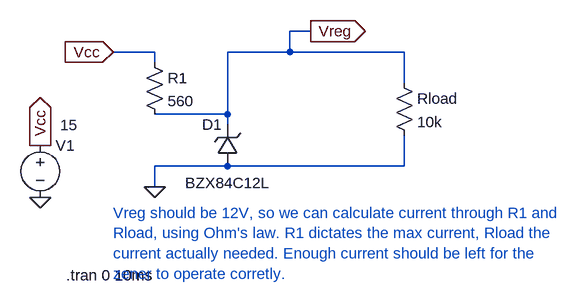
[diagram p0: schematic zener-voltage-regulation.asc]
zener-voltage-regulation.asc, the LTspice schematic file:
Version 4
SHEET 1 2464 680
WIRE 448 144 416 144
WIRE 208 176 144 176
WIRE 416 176 416 144
WIRE 416 176 320 176
WIRE 592 176 416 176
WIRE 208 192 208 176
WIRE 592 224 592 176
WIRE 320 272 320 176
WIRE 320 272 208 272
WIRE 320 288 320 272
WIRE 320 352 208 352
WIRE 592 352 592 304
WIRE 592 352 320 352
WIRE 208 384 208 352
FLAG 208 384 0
FLAG 32 400 0
FLAG 32 320 Vcc
IOPIN 32 320 Out
FLAG 144 176 Vcc
IOPIN 144 176 In
FLAG 448 144 Vreg
IOPIN 448 144 Out
SYMBOL Res 192 176 R0
SYMATTR InstName R1
SYMATTR Value 560
SYMBOL zener 336 352 R180
WINDOW 3 -50 -26 Left 2
WINDOW 0 24 64 Left 2
SYMATTR Value BZX84C12L
SYMATTR InstName D1
SYMBOL Voltage 32 304 R0
WINDOW 3 31 -15 Left 2
SYMATTR Value 15
SYMATTR InstName V1
SYMBOL Res 576 208 R0
SYMATTR InstName Rload
SYMATTR Value 10k
TEXT 72 520 Left 2 !.tran 0 10ms
TEXT 144 424 Left 2 ;Vreg should be 12V, so we can calculate current through R1 and\nRload, using Ohm's law. R1 dictates the max current, Rload the\ncurrent actually needed. Enough current should be left for the\nzener to operate corretly.

The netlist it stands for:
* zener-voltage-regulation.asc
R1 Vcc Vreg 560
D1 0 Vreg BZX84C12L
V1 Vcc 0 15
Rload Vreg 0 10k
.model D D
.lib standard.dio
.tran 0 10ms
* Vreg should be 12V, so we can calculate current through R1 and
* Rload, using Ohm's law. R1 dictates the max current, Rload the
* current actually needed. Enough current should be left for the
* zener to operate corretly.
.backanno
.end